# Altium schematic sheet PMA3-83MP+.SchDoc
size A; SheetNumber: 14; SheetTotal: 15
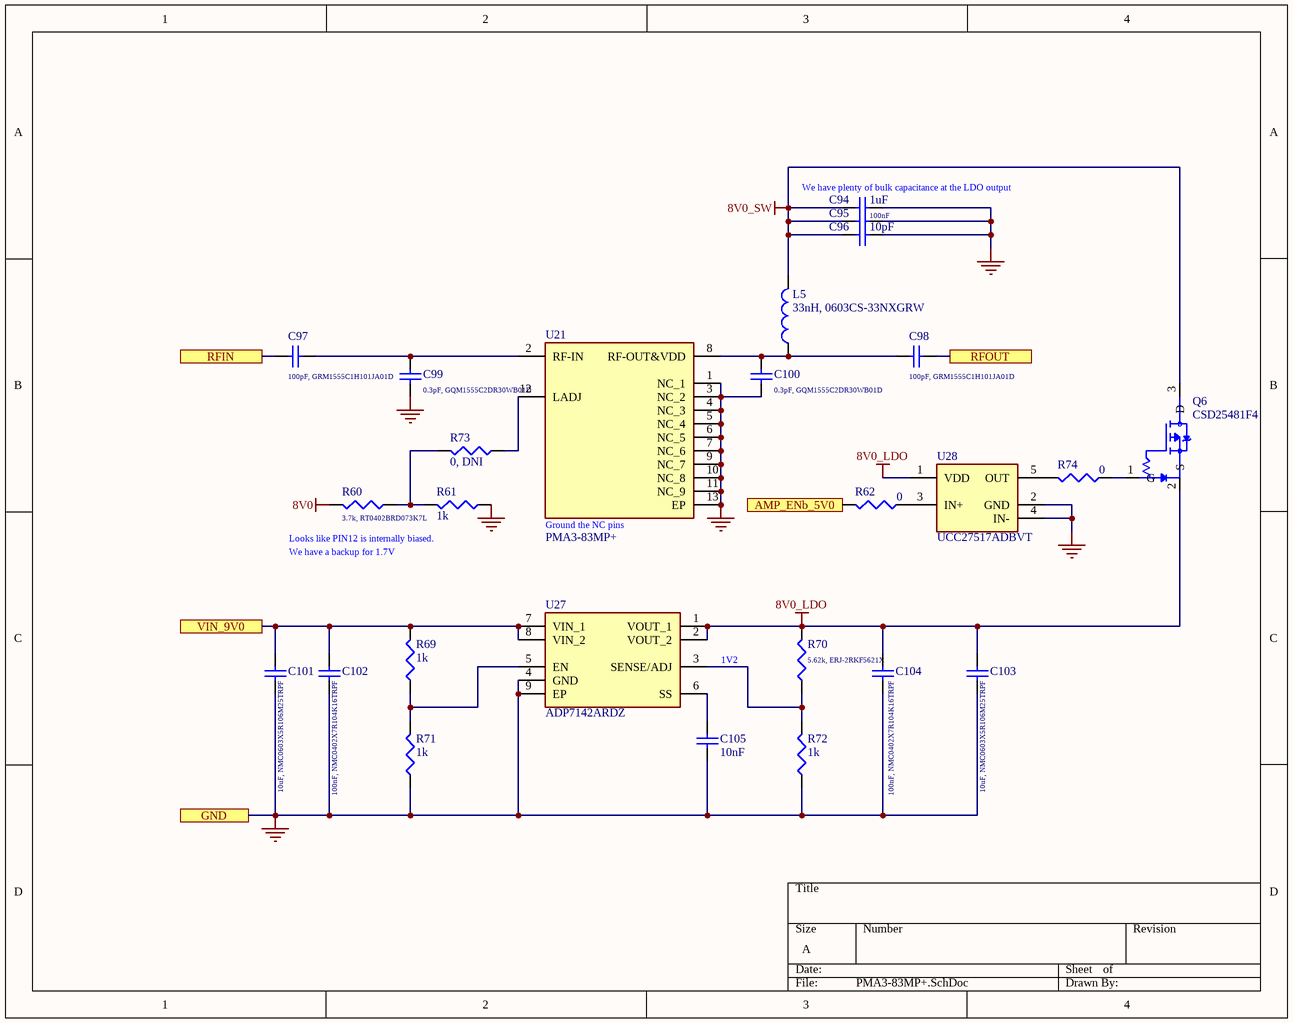
[diagram p0: PMA3-83MP+.SchDoc]

## Parts
C94  1uF  [SMD-0402]
C95  100nF  [SMD-0402]
C96  10pF  [SMD-0402]
C97  100pF, GRM1555C1H101JA01D  [SMD-0402]
C98  100pF, GRM1555C1H101JA01D  [SMD-0402]
C99  0.3pF, GQM1555C2DR30WB01D  [SMD-0402]
C100  0.3pF, GQM1555C2DR30WB01D  [SMD-0402]
C101  10uF, NMC0603X5R106M25TRPF  [SMD-0603]
C102  100nF, NMC0402X7R104K16TRPF  [SMD-0402]
C103  10uF, NMC0603X5R106M25TRPF  [SMD-0603]
C104  100nF, NMC0402X7R104K16TRPF  [SMD-0402]
C105  10nF  [SMD-0402]
L5  33nH, 0603CS-33NXGRW  [SMD-0603]
Q6  CSD25481F4  [CSD25481F4]
R60  3.7k, RT0402BRD073K7L  [SMD-0402]
R61  1k  [SMD-0402]
R62  0  [SMD-0402]
R69  1k  [SMD-0402]
R70  5.62k, ERJ-2RKF5621X  [SMD-0402]
R71  1k  [SMD-0402]
R72  1k  [SMD-0402]
R73  0, DNI  [SMD-0402]
R74  0  [SMD-0402]
U21  PMA3-83MP+  [MiniCircuits PMA3-83MP+]
U27  ADP7142ARDZ  [ADP7142ARDZ]
U28  UCC27517ADBVT  [TI UCC27517ADBVT]

## Ports
AMP_ENb_5V0, GND, RFIN, RFOUT, VIN_9V0

## Nets
8V0: R60.2
8V0_LDO: C103.2 C104.2 Q6.2(S) R70.2 U27.1(VOUT_1) U27.2(VOUT_2) U28.1(VDD)
8V0_SW: C94.1 C95.1 C96.1 L5.2 Q6.3(D)
GND: C94.2 C95.2 C96.2 C99.1 C100.2 C101.1 C102.1 C103.1 C104.1 C105.1 R61.1 R71.1 R72.1 U21.1(NC_1) U21.3(NC_2) U21.4(NC_3) U21.5(NC_4) U21.6(NC_5) U21.7(NC_6) U21.9(NC_7) U21.10(NC_8) U21.11(NC_9) U21.13(EP) U27.4(GND) U27.9(EP) U28.2(GND) U28.4(IN-) ; port GND
AMP_ENb_5V0: R62.2 ; port AMP_ENb_5V0
RFIN: C97.2 ; port RFIN
RFOUT: C98.2 ; port RFOUT
VIN_9V0: C101.2 C102.2 R69.2 U27.7(VIN_1) U27.8(VIN_2) ; port VIN_9V0
NetC97_1: C97.1 C99.2 U21.2(RF-IN)
NetC98_1: C98.1 C100.1 L5.1 U21.8(RF-OUT&VDD)
NetC105_2: C105.2 U27.6(SS)
NetQ6_1: Q6.1(G) R74.1
NetR60_1: R60.1 R61.2 R73.2
NetR62_1: R62.1 U28.3(IN+)
NetR69_1: R69.1 R71.2 U27.5(EN)
NetR70_1: R70.1 R72.2 U27.3(SENSE/ADJ)
NetR73_1: R73.1 U21.12(LADJ)
NetR74_2: R74.2 U28.5(OUT)

## Notes on the sheet
- (near C94) We have plenty of bulk capacitance at the LDO output
- Looks like PIN12 is internally biased.
- We have a backup for 1.7V
- (near U27) 1V2
- (in symbol MiniCircuits PMA3-83MP+) Ground the NC pins

## Library data of the parts
C94-C100 C102 C104 C105 = CAP0402: Ceramic Capacitor 0402
C101 C103 = CAP0603: Ceramic Capacitor 0603
L5 = L0603: Inductor 0603
Q6 = CSD25481F4: -20V, P ch NexFET MOSFET, single LGA 0.6x1.0, 105mOhm 3-PICOSTAR -55 to 150; MF: Texas Instruments; MP: CSD25481F4; Purchase-URL: https://pricing.snapeda.com/search/part/CSD25481F4/?ref=eda; Price: None; SnapEDA_Link: https://www.snapeda.com/parts/CSD25481F4/Texas%20Instruments/view-part/808987/?ref=snap; Check_prices: https://www.snapeda.com/parts/CSD25481F4/Texas%20Instruments/view-part/808987/?ref=eda; Package: PICOSTAR-3 Texas Instruments; Availability: Good; Value: *
R60-R62 R69-R74 = RES0402: Resistor-0402
U21 = MiniCircuits PMA3-83MP+: RF Amplifier SMT Gain Block, 400 - 8000 MHz, 50 Ohm; Manufacturer_Name: Mini-Circuits; Geometry.Height: 0.89mm; Manufacturer_Part_Number: PMA3-83MP+; Mouser Part Number: 139-PMA3-83MP+; Mouser Price/Stock: https://www.mouser.co.uk/ProductDetail/Mini-Circuits/PMA3-83MP%2b?qs=t7xnP681wgVrgODXnnL%252BqQ%3D%3D; Arrow Part Number: *; Arrow Price/Stock: *; Datasheet Link: https://www.mouser.com/datasheet/2/1030/PMA3_83MP_2b-2941862.pdf
U27 = ADP7142ARDZ: 40 V, 200 mA, Low Noise, CMOS LDO Linear Regulator; Manufacturer_Name: Analog Devices; Geometry.Height: 1.75mm; Manufacturer_Part_Number: ADP7142ARDZ; Mouser Part Number: 584-ADP7142ARDZ; Mouser Price/Stock: https://www.mouser.co.uk/ProductDetail/Analog-Devices/ADP7142ARDZ?qs=hpwIUhX6lWzV4WLkPn0q6A%3D%3D; Arrow Part Number: ADP7142ARDZ; Arrow Price/Stock: https://www.arrow.com/en/products/adp7142ardz/analog-devices?region=europe; Datasheet Link: https://www.analog.com/ADP7142/datasheet
U28 = TI UCC27517ADBVT: 4A/4A Single Channel High-speed Low-side Gate Driver with 5V Negative Input Voltage Handling Ability; Manufacturer_Name: Texas Instruments; Geometry.Height: 1.45mm; Manufacturer_Part_Number: UCC27517ADBVT; Mouser Part Number: 595-UCC27517ADBVT; Mouser Price/Stock: https://www.mouser.co.uk/ProductDetail/Texas-Instruments/UCC27517ADBVT?qs=e5T%2FzGlhGOYaAK84OEzaaQ%3D%3D; Arrow Part Number: UCC27517ADBVT; Arrow Price/Stock: https://www.arrow.com/en/products/ucc27517adbvt_1/texas-instruments.html?utm_currency=USD&region=nac; Datasheet Link: http://www.ti.com/general/docs/lit/getliterature.tsp?genericPartNumber=UCC27517A&&fileType=pdf